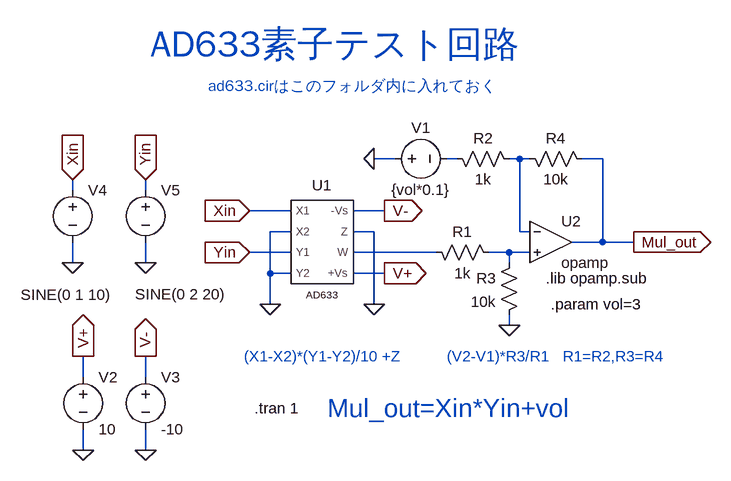
[diagram p0: schematic mul_lv2_test.asc]
mul_lv2_test.asc, the LTspice schematic file:
Version 4.1
SHEET 1 880 680
WIRE 320 -32 288 -32
WIRE 416 -32 400 -32
WIRE 512 -32 496 -32
WIRE 528 -32 512 -32
WIRE 640 -32 608 -32
WIRE -176 16 -176 0
WIRE -64 16 -64 0
WIRE 160 48 96 48
WIRE 304 48 256 48
WIRE 160 80 128 80
WIRE 288 80 256 80
WIRE 512 80 512 -32
WIRE 528 80 512 80
WIRE 640 96 640 -32
WIRE 640 96 592 96
WIRE 688 96 640 96
WIRE 160 112 96 112
WIRE 384 112 256 112
WIRE 496 112 464 112
WIRE 528 112 496 112
WIRE -176 128 -176 96
WIRE -64 128 -64 96
WIRE 496 128 496 112
WIRE 128 144 128 80
WIRE 160 144 128 144
WIRE 304 144 256 144
WIRE 128 192 128 144
WIRE 288 192 288 80
WIRE 496 224 496 208
WIRE -160 304 -160 272
WIRE -64 304 -64 272
WIRE -160 416 -160 384
WIRE -64 416 -64 384
FLAG 688 96 Mul_out
IOPIN 688 96 Out
FLAG 496 224 0
FLAG 304 144 V+
IOPIN 304 144 Out
FLAG 304 48 V-
IOPIN 304 48 Out
FLAG 96 48 Xin
IOPIN 96 48 In
FLAG 96 112 Yin
IOPIN 96 112 In
FLAG 128 192 0
FLAG 288 192 0
FLAG 288 -32 0
FLAG -160 416 0
FLAG -64 416 0
FLAG -160 272 V+
IOPIN -160 272 Out
FLAG -64 272 V-
IOPIN -64 272 Out
FLAG -176 128 0
FLAG -64 128 0
FLAG -176 0 Xin
IOPIN -176 0 In
FLAG -64 0 Yin
IOPIN -64 0 In
SYMBOL res 368 96 M90
WINDOW 0 0 56 VBottom 2
WINDOW 3 32 56 VTop 2
SYMATTR InstName R1
SYMATTR Value 1k
SYMBOL res 400 -48 M90
WINDOW 0 0 56 VBottom 2
WINDOW 3 32 56 VTop 2
SYMATTR InstName R2
SYMATTR Value 1k
SYMBOL res 512 112 M0
SYMATTR InstName R3
SYMATTR Value 10k
SYMBOL res 512 -48 M90
WINDOW 0 0 56 VBottom 2
WINDOW 3 32 56 VTop 2
SYMATTR InstName R4
SYMATTR Value 10k
SYMBOL OpAmps\\opamp 560 32 R0
SYMATTR InstName U2
SYMBOL voltage -160 288 R0
WINDOW 123 0 0 Left 0
WINDOW 39 0 0 Left 0
SYMATTR InstName V2
SYMATTR Value 10
SYMBOL voltage -64 288 R0
WINDOW 123 0 0 Left 0
WINDOW 39 0 0 Left 0
SYMATTR InstName V3
SYMATTR Value -10
SYMBOL voltage -176 0 R0
WINDOW 3 -80 177 Left 2
WINDOW 123 0 0 Left 0
WINDOW 39 0 0 Left 0
SYMATTR Value SINE(0 1 10)
SYMATTR InstName V4
SYMBOL voltage -64 0 R0
WINDOW 3 -16 176 Left 2
WINDOW 123 0 0 Left 0
WINDOW 39 0 0 Left 0
SYMATTR Value SINE(0 2 20)
SYMATTR InstName V5
SYMBOL AD633 192 96 R0
SYMATTR InstName U1
SYMBOL voltage 304 -32 M90
WINDOW 0 -32 56 VBottom 2
WINDOW 3 32 56 VTop 2
WINDOW 123 0 0 Left 0
WINDOW 39 0 0 Left 0
SYMATTR InstName V1
SYMATTR Value {vol*0.1}
TEXT 88 272 Left 2 ;(X1-X2)*(Y1-Y2)/10 +Z
TEXT 400 272 Left 2 ;(V2-V1)*R3/R1   R1=R2,R3=R4
TEXT 104 352 Left 2 !.tran 1
TEXT 552 152 Left 2 !.lib opamp.sub
TEXT -56 -208 Left 5 ;AD633素子テスト回路
TEXT 32 -144 Left 2 ;ad633.cirはこのフォルダ内に入れておく
TEXT 216 352 Left 4 ;Mul_out=Xin*Yin+vol
TEXT 560 192 Left 2 !.param vol=3

The netlist it stands for:
* mul_lv2_test.asc
R1 N003 N004 1k
R2 N001 N002 1k
R3 N004 0 10k
R4 N002 Mul_out 10k
X§U2 N002 N004 Mul_out opamp Aol=100K GBW=10Meg  ; pins invin noninvin out
V2 V+ 0 10
V3 V- 0 -10
V4 Xin 0 SINE(0 1 10)
V5 Yin 0 SINE(0 2 20)
X§U1 Xin 0 Yin 0 V- 0 N003 V+ AD633  ; pins X1 X2 Y1 Y2 -Vs Z W +Vs
V1 0 N001 {vol*0.1}
* (X1-X2)*(Y1-Y2)/10 +Z
* (V2-V1)*R3/R1   R1=R2,R3=R4
.tran 1
.lib opamp.sub
* AD633素子テスト回路
* ad633.cirはこのフォルダ内に入れておく
* Mul_out=Xin*Yin+vol
.param vol=3
.lib ad633.cir
.backanno
.end